# Altium schematic sheet Gesture.SchDoc
size A4
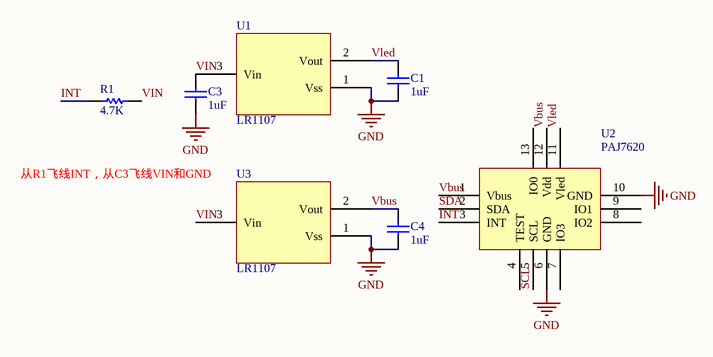
[diagram p0: Gesture.SchDoc]

## Parts
C1  value 1uF  [C0603]  (hidden comment: 0.1uF)
C3  value 1uF  [C0603]  (hidden comment: 0.1uF)
C4  value 1uF  [C0603]  (hidden comment: 0.1uF)
R1  4.7K  [0603-1]
U1  LR1107  [SOT23A]
U2  PAJ7620  [PAJ7620]
U3  LR1107  [SOT23A]

## Nets
GND: C1.1 C3.1 C4.1 U1.1(Vss) U2.6(GND) U2.10(GND) U3.1(Vss)
INT: R1.1 U2.3(INT)
SCL: U2.5(SCL)
SDA: U2.2(SDA)
Vbus: C4.2 U2.1(Vbus) U2.12(Vdd) U3.2(Vout)
VIN: C3.2 R1.2 U1.3(Vin) U3.3(Vin)
Vled: C1.2 U1.2(Vout) U2.11(Vled)

Not connected (* = marked no-connect by the designer): U2 4(TEST) 7(IO3) 8(IO2) 9(IO1) 13(IO0)

## Notes on the sheet
- 从R1飞线INT，从C3飞线VIN和GND

## Library data of the parts
C1 C3 C4 = Cap: Capacitor; Published: 8-Jun-2000; LatestRevisionDate: 17-Jul-2002; LatestRevisionNote: Re-released for DXP Platform.; PackageReference: RAD-0.3; Publisher: Altium Limited
R1 = Res1: Resistor; Published: 8-Jun-2000; LatestRevisionDate: 17-Jul-2002; LatestRevisionNote: Re-released for DXP Platform.; PackageReference: AXIAL-0.3; Publisher: Altium Limited; Value: 4.7K
U1 U3 = XC6206